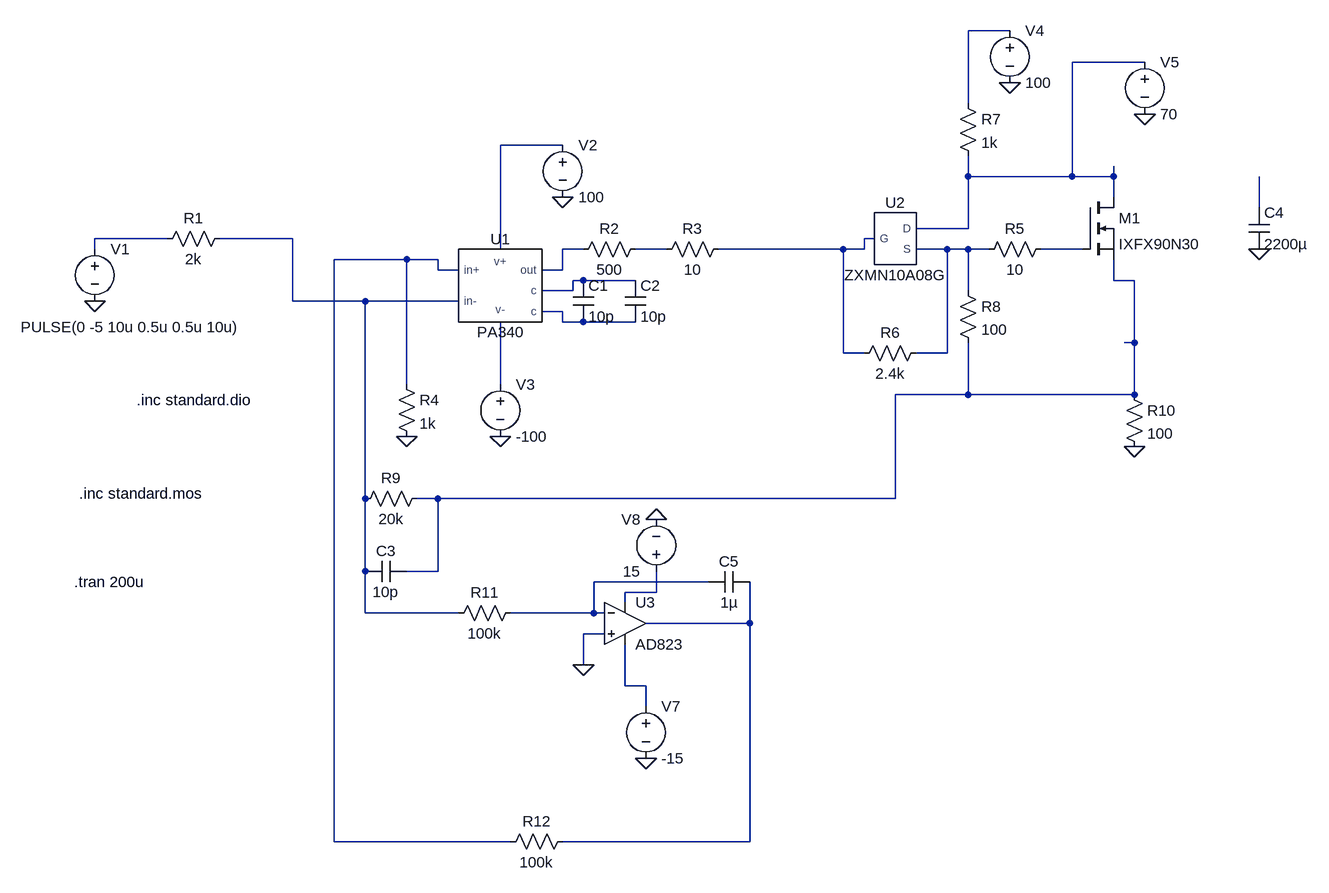
[diagram p0: schematic Draft1.asc]
Draft1.asc, the LTspice schematic file:
Version 4.1
SHEET 1 1536 1056
WIRE 880 -240 816 -240
WIRE 1088 -192 976 -192
WIRE 816 -128 816 -240
WIRE 192 -64 96 -64
WIRE 816 -16 816 -48
WIRE 976 -16 976 -192
WIRE 976 -16 816 -16
WIRE 1040 -16 1040 -32
WIRE 1040 -16 976 -16
WIRE 1040 16 1040 -16
WIRE 1264 32 1264 -16
WIRE 816 64 816 -16
WIRE 816 64 736 64
WIRE -416 80 -528 80
WIRE -224 80 -336 80
WIRE 672 80 656 80
WIRE -528 96 -528 80
WIRE 96 96 96 -64
WIRE 224 96 192 96
WIRE 352 96 304 96
WIRE 624 96 432 96
WIRE 656 96 656 80
WIRE 656 96 624 96
WIRE 784 96 736 96
WIRE 816 96 784 96
WIRE 848 96 816 96
WIRE 992 96 928 96
WIRE -48 112 -160 112
WIRE 0 112 -48 112
WIRE 0 128 0 112
WIRE 32 128 0 128
WIRE 192 128 192 96
WIRE 192 128 160 128
WIRE 224 144 208 144
WIRE 304 144 224 144
WIRE 1040 144 1040 112
WIRE 1072 144 1040 144
WIRE 208 160 208 144
WIRE 208 160 160 160
WIRE 816 160 816 96
WIRE -224 176 -224 80
WIRE -112 176 -224 176
WIRE 32 176 -112 176
WIRE 192 192 160 192
WIRE 192 208 192 192
WIRE 224 208 192 208
WIRE 304 208 224 208
WIRE 1072 240 1072 144
WIRE 1072 240 1056 240
WIRE 624 256 624 96
WIRE 656 256 624 256
WIRE 784 256 784 96
WIRE 784 256 736 256
WIRE -48 304 -48 112
WIRE 96 304 96 208
WIRE 816 320 816 240
WIRE 816 320 704 320
WIRE 1072 320 1072 240
WIRE 1072 320 816 320
WIRE -112 480 -112 176
WIRE 0 480 -32 480
WIRE 704 480 704 320
WIRE 704 480 0 480
WIRE -112 592 -112 480
WIRE 0 592 0 480
WIRE 0 592 -48 592
WIRE 416 608 240 608
WIRE 336 624 336 592
WIRE 336 624 288 624
WIRE 288 640 288 624
WIRE -112 656 -112 592
WIRE 32 656 -112 656
WIRE 240 656 240 608
WIRE 240 656 112 656
WIRE 256 656 240 656
WIRE 480 672 480 608
WIRE 480 672 320 672
WIRE 256 688 224 688
WIRE 224 736 224 688
WIRE 288 768 288 704
WIRE 320 768 288 768
WIRE 320 800 320 768
WIRE -160 1008 -160 112
WIRE 112 1008 -160 1008
WIRE 480 1008 480 672
WIRE 480 1008 192 1008
FLAG -528 176 0
FLAG 96 384 0
FLAG 192 16 0
FLAG -48 384 0
FLAG 880 -160 0
FLAG 1088 -112 0
FLAG 1264 96 0
FLAG 1072 400 0
FLAG 224 736 0
FLAG 336 512 0
FLAG 320 880 0
SYMBOL PA340 80 144 R0
SYMATTR InstName U1
SYMBOL cap 208 144 R0
SYMATTR InstName C1
SYMATTR Value 10p
SYMBOL cap 288 144 R0
SYMATTR InstName C2
SYMATTR Value 10p
SYMBOL res -320 64 R90
WINDOW 0 0 56 VBottom 2
WINDOW 3 32 56 VTop 2
SYMATTR InstName R1
SYMATTR Value 2k
SYMBOL voltage -528 80 R0
WINDOW 123 0 0 Left 0
WINDOW 39 0 0 Left 0
WINDOW 3 -114 136 Left 2
SYMATTR Value PULSE(0 -5 10u 0.5u 0.5u 10u)
SYMATTR InstName V1
SYMBOL voltage 192 -80 R0
WINDOW 123 0 0 Left 0
WINDOW 39 0 0 Left 0
SYMATTR InstName V2
SYMATTR Value 100
SYMBOL voltage 96 288 R0
WINDOW 123 0 0 Left 0
WINDOW 39 0 0 Left 0
SYMATTR InstName V3
SYMATTR Value -100
SYMBOL res 320 80 R90
WINDOW 0 0 56 VBottom 2
WINDOW 3 32 56 VTop 2
SYMATTR InstName R2
SYMATTR Value 500
SYMBOL res -64 288 R0
SYMATTR InstName R4
SYMATTR Value 1k
SYMBOL ZXMN10A08G 704 80 R0
SYMATTR InstName U2
SYMBOL res 944 80 R90
WINDOW 0 0 56 VBottom 2
WINDOW 3 32 56 VTop 2
SYMATTR InstName R5
SYMATTR Value 10
SYMBOL nmos 992 16 R0
SYMATTR InstName M1
SYMATTR Value IXFX90N30
SYMBOL res 752 240 R90
WINDOW 0 0 56 VBottom 2
WINDOW 3 32 56 VTop 2
SYMATTR InstName R6
SYMATTR Value 2.4k
SYMBOL res 800 -144 R0
SYMATTR InstName R7
SYMATTR Value 1k
SYMBOL voltage 880 -256 R0
WINDOW 123 0 0 Left 0
WINDOW 39 0 0 Left 0
SYMATTR InstName V4
SYMATTR Value 100
SYMBOL res -16 464 R90
WINDOW 0 0 56 VBottom 2
WINDOW 3 32 56 VTop 2
SYMATTR InstName R9
SYMATTR Value 20k
SYMBOL cap -48 576 R90
WINDOW 0 0 32 VBottom 2
WINDOW 3 32 32 VTop 2
SYMATTR InstName C3
SYMATTR Value 10p
SYMBOL voltage 1088 -208 R0
WINDOW 123 0 0 Left 0
WINDOW 39 0 0 Left 0
SYMATTR InstName V5
SYMATTR Value 70
SYMBOL cap 1248 32 R0
SYMATTR InstName C4
SYMATTR Value 2200µ
SYMBOL res 1056 304 R0
SYMATTR InstName R10
SYMATTR Value 100
SYMBOL res 800 144 R0
SYMATTR InstName R8
SYMATTR Value 100
SYMBOL res 448 80 R90
WINDOW 0 0 56 VBottom 2
WINDOW 3 32 56 VTop 2
SYMATTR InstName R3
SYMATTR Value 10
SYMBOL OpAmps\\AD823 288 608 R0
SYMATTR InstName U3
SYMBOL voltage 320 784 R0
WINDOW 123 0 0 Left 0
WINDOW 39 0 0 Left 0
SYMATTR InstName V7
SYMATTR Value -15
SYMBOL voltage 336 608 R180
WINDOW 0 24 96 Left 2
WINDOW 3 24 16 Left 2
WINDOW 123 0 0 Left 0
WINDOW 39 0 0 Left 0
SYMATTR InstName V8
SYMATTR Value 15
SYMBOL res 128 640 R90
WINDOW 0 0 56 VBottom 2
WINDOW 3 32 56 VTop 2
SYMATTR InstName R11
SYMATTR Value 100k
SYMBOL res 208 992 R90
WINDOW 0 0 56 VBottom 2
WINDOW 3 32 56 VTop 2
SYMATTR InstName R12
SYMATTR Value 100k
SYMBOL cap 480 592 R90
WINDOW 0 0 32 VBottom 2
WINDOW 3 32 32 VTop 2
SYMATTR InstName C5
SYMATTR Value 1µ
TEXT -560 608 Left 2 !.tran 200u
TEXT -464 328 Left 2 !.inc standard.dio
TEXT -552 472 Left 2 !.inc standard.mos

The netlist it stands for:
* Draft1.asc
X§U1 N012 N006 N003 N016 N008 N013 N015 PA340  ; pins in+ in- v+ v- out c c
C1 N013 N015 10p
C2 N013 N015 10p
R1 N006 N005 2k
V1 N005 0 PULSE(0 -5 10u 0.5u 0.5u 10u)
V2 N003 0 100
V3 N016 0 -100
R2 N009 N008 500
R4 N012 0 1k
X§U2 N002 N007 N010 ZXMN10A08G  ; pins D G S
R5 N011 N010 10
M1 N002 N011 N014 N014 IXFX90N30
R6 N010 N007 2.4k
R7 N001 N002 1k
V4 N001 0 100
R9 N014 N006 20k
C3 N014 N006 10p
V5 N002 0 70
C4 N004 0 2200µ
R10 N014 0 100
R8 N010 N014 100
R3 N007 N009 10
X§U3 0 N017 N018 N020 N019 AD823  ; pins In+ In- V+ V- OUT
V7 N020 0 -15
V8 N018 0 15
R11 N017 N006 100k
R12 N019 N012 100k
C5 N019 N017 1µ
.model NMOS NMOS
.model PMOS PMOS
.lib standard.mos
.tran 200u
.inc standard.dio
.inc standard.mos
.lib ./PA340_Pspice.LIB
.lib ./ZXMN10A08G.Lib
.lib ADI.lib
.backanno
.end